# EAGLE schematic 9-de-8 (EAGLE 6.6.0), part 1 of 2

## Sheet 1 of 3
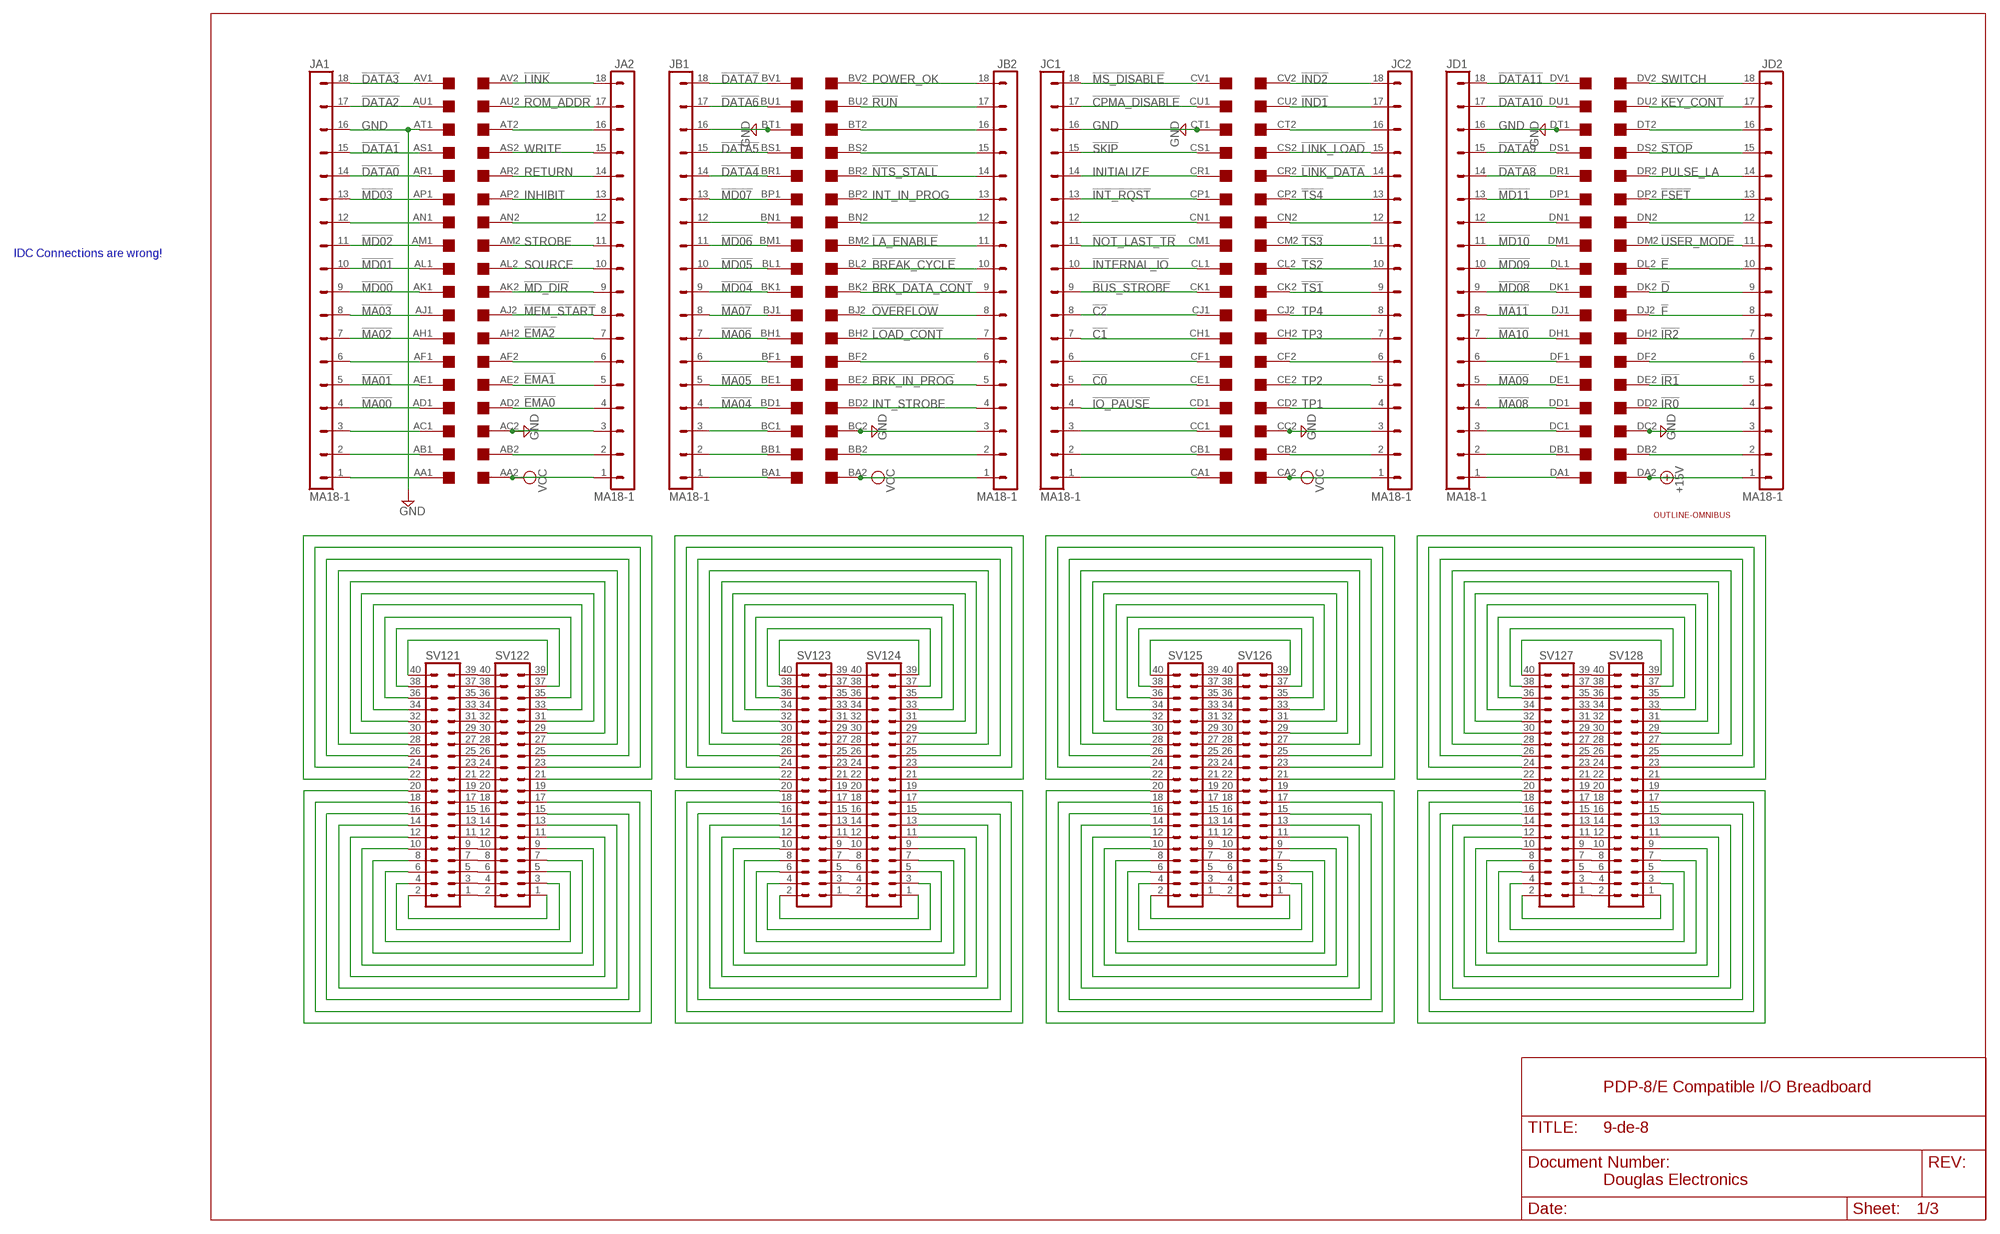
[diagram p0: schematic, sheet 1]

### Parts
JA1  MA18-1  [MA18-1]
JA2  MA18-1  [MA18-1]
JB1  MA18-1  [MA18-1]
JB2  MA18-1  [MA18-1]
JC1  MA18-1  [MA18-1]
JC2  MA18-1  [MA18-1]
JD1  MA18-1  [MA18-1]
JD2  MA18-1  [MA18-1]
SV121  MA20-2  [MA20-2]
SV122  MA20-2  [MA20-2]
SV123  MA20-2  [MA20-2]
SV124  MA20-2  [MA20-2]
SV125  MA20-2  [MA20-2]
SV126  MA20-2  [MA20-2]
SV127  MA20-2  [MA20-2]
SV128  MA20-2  [MA20-2]
U$1  OUTLINE-OMNIBUS  [OMNIBUS]
U$2  QUAD  [EDGE-CON8]

### Nets
!BREAK_CYCLE: JB2.10 U$2.BL2
!BRK_DATA_CONT: JB2.9 U$2.BK2
!BRK_IN_PROG: JB2.5 U$2.BE2
!BUS_STROBE: JC1.9 U$2.CK1
!C0: JC1.5 U$2.CE1
!C1: JC1.7 U$2.CH1
!C2: JC1.8 U$2.CJ1
!CPMA_DISABLE: JC1.17 U$2.CU1
!D: JD2.9 U$2.DK2
!DATA0: JA1.14 U$2.AR1
!DATA1: JA1.15 U$2.AS1
!DATA2: JA1.17 U$2.AU1
!DATA3: JA1.18 U$2.AV1
!DATA4: JB1.14 U$2.BR1
!DATA5: JB1.15 U$2.BS1
!DATA6: JB1.17 U$2.BU1
!DATA7: JB1.18 U$2.BV1
!DATA8: JD1.14 U$2.DR1
!DATA9: JD1.15 U$2.DS1
!DATA10: JD1.17 U$2.DU1
!DATA11: JD1.18 U$2.DV1
!E: JD2.10 U$2.DL2
!EMA0: JA2.4 U$2.AD2
!EMA1: JA2.5 U$2.AE2
!EMA2: JA2.7 U$2.AH2
!F: JD2.8 U$2.DJ2
!FSET: JD2.13 U$2.DP2
!IND1: JC2.17 U$2.CU2
!IND2: JC2.18 U$2.CV2
!INT_RQST: JC1.13 U$2.CP1
!INTERNAL_IO: JC1.10 U$2.CL1
!IO_PAUSE: JC1.4 U$2.CD1
!IR0: JD2.4 U$2.DD2
!IR1: JD2.5 U$2.DE2
!IR2: JD2.7 U$2.DH2
!KEY_CONT: JD2.17 U$2.DU2
!LA_ENABLE: JB2.11 U$2.BM2
!LINK: JA2.18 U$2.AV2
!LINK_DATA: JC2.14 U$2.CR2
!LINK_LOAD: JC2.15 U$2.CS2
!LOAD_CONT: JB2.7 U$2.BH2
!MA00: JA1.4 U$2.AD1
!MA01: JA1.5 U$2.AE1
!MA02: JA1.7 U$2.AH1
!MA03: JA1.8 U$2.AJ1
!MA04: JB1.4 U$2.BD1
!MA05: JB1.5 U$2.BE1
!MA06: JB1.7 U$2.BH1
!MA07: JB1.8 U$2.BJ1
!MA08: JD1.4 U$2.DD1
!MA09: JD1.5 U$2.DE1
!MA10: JD1.7 U$2.DH1
!MA11: JD1.8 U$2.DJ1
!MD00: JA1.9 U$2.AK1
!MD01: JA1.10 U$2.AL1
!MD02: JA1.11 U$2.AM1
!MD03: JA1.13 U$2.AP1
!MD04: JB1.9 U$2.BK1
!MD05: JB1.10 U$2.BL1
!MD06: JB1.11 U$2.BM1
!MD07: JB1.13 U$2.BP1
!MD08: JD1.9 U$2.DK1
!MD09: JD1.10 U$2.DL1
!MD10: JD1.11 U$2.DM1
!MD11: JD1.13 U$2.DP1
!MD_DIR: JA2.9 U$2.AK2
!MEM_START: JA2.8 U$2.AJ2
!MS_DISABLE: JC1.18 U$2.CV1
!NOT_LAST_TR: JC1.11 U$2.CM1
!NTS_STALL: JB2.14 U$2.BR2
!OVERFLOW: JB2.8 U$2.BJ2
!ROM_ADDR: JA2.17 U$2.AU2
!RUN: JB2.17 U$2.BU2
!SKIP: JC1.15 U$2.CS1
!STOP: JD2.15 U$2.DS2
!TS1: JC2.9 U$2.CK2
!TS2: JC2.10 U$2.CL2
!TS3: JC2.11 U$2.CM2
!TS4: JC2.13 U$2.CP2
!USER_MODE: JD2.11 U$2.DM2
+15V: JD2.1 U$2.DA2
GND [supply]: JA1.16 JA2.3 JB1.16 JB2.3 JC1.16 JC2.3 JD1.16 JD2.3 U$2.AC2 U$2.AT1 U$2.BC2 U$2.BT1 U$2.CC2 U$2.CT1 U$2.DC2 U$2.DT1 ; also sheet 3
INHIBIT: JA2.13 U$2.AP2
INITIALIZE: JC1.14 U$2.CR1
INT_IN_PROG: JB2.13 U$2.BP2
INT_STROBE: JB2.4 U$2.BD2
N$46: JA1.2 U$2.AB1
N$47: JA1.1 U$2.AA1
N$48: JB1.2 U$2.BB1
N$49: JB1.1 U$2.BA1
N$50: JC1.1 U$2.CA1
N$51: JB2.15 U$2.BS2
N$52: JC1.2 U$2.CB1
N$53: JD1.1 U$2.DA1
N$54: JD1.2 U$2.DB1
N$243: SV121.1 SV122.2
N$244: SV121.3 SV122.4
N$245: SV121.5 SV122.6
N$246: SV121.7 SV122.8
N$479: SV121.9 SV122.10
N$480: SV121.11 SV122.12
N$481: SV121.13 SV122.14
N$482: SV121.15 SV122.16
N$483: SV121.17 SV122.18
N$484: SV121.19 SV122.20
N$485: SV121.21 SV122.22
N$486: SV121.23 SV122.24
N$487: SV121.25 SV122.26
N$488: SV121.27 SV122.28
N$489: SV121.29 SV122.30
N$490: SV121.31 SV122.32
N$491: SV121.33 SV122.34
N$492: SV121.35 SV122.36
N$493: SV121.37 SV122.38
N$494: SV121.39 SV122.40
N$495: SV123.1 SV124.2
N$496: SV123.3 SV124.4
N$497: SV123.5 SV124.6
N$498: SV123.7 SV124.8
N$499: SV123.9 SV124.10
N$500: SV123.11 SV124.12
N$501: SV123.13 SV124.14
N$502: SV123.15 SV124.16
N$503: SV123.17 SV124.18
N$504: SV123.19 SV124.20
N$505: SV123.21 SV124.22
N$506: SV123.23 SV124.24
N$507: SV123.25 SV124.26
N$508: SV123.27 SV124.28
N$509: SV123.29 SV124.30
N$510: SV123.31 SV124.32
N$511: SV123.33 SV124.34
N$512: SV123.35 SV124.36
N$513: SV123.37 SV124.38
N$514: SV123.39 SV124.40
N$515: SV123.40 SV124.39
N$516: SV123.38 SV124.37
N$517: SV123.36 SV124.35
N$518: SV123.34 SV124.33
N$519: SV123.32 SV124.31
N$520: SV123.2 SV124.1
N$521: SV123.4 SV124.3
N$522: SV123.6 SV124.5
N$523: SV123.8 SV124.7
N$524: SV123.10 SV124.9
N$525: SV123.12 SV124.11
N$526: SV123.30 SV124.29
N$527: SV123.14 SV124.13
N$528: SV123.18 SV124.17
N$529: SV123.20 SV124.19
N$530: SV123.22 SV124.21
N$531: SV123.24 SV124.23
N$532: SV123.26 SV124.25
N$533: SV123.28 SV124.27
N$534: SV123.16 SV124.15
N$535: SV125.1 SV126.2
N$536: SV125.3 SV126.4
N$537: SV125.5 SV126.6
N$538: SV125.7 SV126.8
N$539: SV125.9 SV126.10
N$540: SV125.11 SV126.12
N$541: SV125.13 SV126.14
N$542: SV125.15 SV126.16
N$543: SV125.17 SV126.18
N$544: SV125.19 SV126.20
N$545: SV125.21 SV126.22
N$546: SV125.23 SV126.24
N$547: SV125.25 SV126.26
N$548: SV125.27 SV126.28
N$549: SV125.29 SV126.30
N$550: SV125.31 SV126.32
N$551: SV125.33 SV126.34
N$552: SV125.35 SV126.36
N$553: SV125.37 SV126.38
N$554: SV125.39 SV126.40
N$555: SV121.40 SV122.39
N$556: SV121.38 SV122.37
N$557: SV121.36 SV122.35
N$558: SV121.34 SV122.33
N$559: SV121.32 SV122.31
N$560: SV121.2 SV122.1
N$561: SV121.4 SV122.3
N$562: SV121.6 SV122.5
N$1074: SV121.8 SV122.7
N$1075: SV121.10 SV122.9
N$1076: SV121.12 SV122.11
N$1077: SV121.30 SV122.29
N$1078: SV121.14 SV122.13
N$1079: SV121.16 SV122.15
N$1080: SV121.18 SV122.17
N$1081: SV121.20 SV122.19
N$1082: SV121.22 SV122.21
N$1083: SV121.24 SV122.23
N$1084: SV121.26 SV122.25
N$1085: SV121.28 SV122.27
N$1086: SV125.40 SV126.39
N$1087: SV125.38 SV126.37
N$1088: SV125.36 SV126.35
N$1089: SV125.34 SV126.33
N$1090: SV125.32 SV126.31
N$1091: SV125.2 SV126.1
N$1092: SV125.4 SV126.3
N$1093: SV125.6 SV126.5
N$1094: SV125.8 SV126.7
N$1095: SV125.10 SV126.9
N$1096: SV125.12 SV126.11
N$1097: SV125.30 SV126.29
N$1098: SV125.14 SV126.13
N$1099: SV125.18 SV126.17
N$1100: SV125.20 SV126.19
N$1101: SV125.22 SV126.21
N$1102: SV125.24 SV126.23
N$1103: SV125.26 SV126.25
N$1104: SV125.28 SV126.27
N$1105: SV125.16 SV126.15
N$1106: SV127.1 SV128.2
N$1107: SV127.3 SV128.4
N$1108: SV127.5 SV128.6
N$1109: SV127.7 SV128.8
N$1110: SV127.9 SV128.10
N$1111: SV127.11 SV128.12
N$1112: SV127.13 SV128.14
N$1113: SV127.15 SV128.16
N$1114: SV127.17 SV128.18
N$1115: SV127.19 SV128.20
N$1116: SV127.21 SV128.22
N$1117: SV127.23 SV128.24
N$1118: SV127.25 SV128.26
N$1119: SV127.27 SV128.28
N$1120: SV127.29 SV128.30
N$1121: SV127.31 SV128.32
N$1122: SV127.33 SV128.34
N$1123: SV127.35 SV128.36
N$1124: SV127.37 SV128.38
N$1125: SV127.39 SV128.40
N$1126: SV127.40 SV128.39
N$1127: SV127.38 SV128.37
N$1128: SV127.36 SV128.35
N$1129: SV127.34 SV128.33
N$1130: SV127.32 SV128.31
N$1131: SV127.2 SV128.1
N$1132: SV127.4 SV128.3
N$1133: SV127.6 SV128.5
N$1134: SV127.8 SV128.7
N$1135: SV127.10 SV128.9
N$1136: SV127.12 SV128.11
N$1137: SV127.30 SV128.29
N$1138: SV127.14 SV128.13
N$1139: SV127.18 SV128.17
N$1140: SV127.20 SV128.19
N$1141: SV127.22 SV128.21
N$1142: SV127.24 SV128.23
N$1143: SV127.26 SV128.25
N$1144: SV127.28 SV128.27
N$1145: SV127.16 SV128.15
N$1338 [supply]: JA2.6 U$2.AF2
N$1339 [supply]: JB1.6 U$2.BF1
N$1340 [supply]: JB2.6 U$2.BF2
N$1341 [supply]: JC1.6 U$2.CF1
N$1342 [supply]: JC2.6 U$2.CF2
N$1343 [supply]: JD1.6 U$2.DF1
N$1344 [supply]: JD2.6 U$2.DF2
N$1345 [supply]: JD2.12 U$2.DN2
N$1346 [supply]: JD1.12 U$2.DN1
N$1347 [supply]: JC2.12 U$2.CN2
N$1348 [supply]: JC1.12 U$2.CN1
N$1349 [supply]: JB1.12 U$2.BN1
N$1350 [supply]: JB2.12 U$2.BN2
N$1351 [supply]: JA1.6 U$2.AF1
N$1352 [supply]: JA1.12 U$2.AN1
N$1353 [supply]: JA2.12 U$2.AN2
N$1354 [supply]: JA2.16 U$2.AT2
N$1355 [supply]: JB2.16 U$2.BT2
N$1356 [supply]: JC2.16 U$2.CT2
N$1357 [supply]: JD2.16 U$2.DT2
N$1358 [supply]: JA1.3 U$2.AC1
N$1359 [supply]: JB1.3 U$2.BC1
N$1360 [supply]: JC1.3 U$2.CC1
N$1361 [supply]: JD1.3 U$2.DC1
N$1362 [supply]: JA2.2 U$2.AB2
N$1363 [supply]: JB2.2 U$2.BB2
N$1364 [supply]: JC2.2 U$2.CB2
N$1365 [supply]: JD2.2 U$2.DB2
POWER_OK: JB2.18 U$2.BV2
PULSE_LA: JD2.14 U$2.DR2
RETURN: JA2.14 U$2.AR2
SOURCE: JA2.10 U$2.AL2
STROBE: JA2.11 U$2.AM2
SWITCH: JD2.18 U$2.DV2
TP1: JC2.4 U$2.CD2
TP2: JC2.5 U$2.CE2
TP3: JC2.7 U$2.CH2
TP4: JC2.8 U$2.CJ2
VCC [supply]: JA2.1 JB2.1 JC2.1 U$2.AA2 U$2.BA2 U$2.CA2 ; also sheet 3
WRITE: JA2.15 U$2.AS2

### Notes on the sheet
- IDC Connections are wrong!
- PDP-8/E Compatible I/O Breadboard
- Douglas Electronics

## Sheet 2 of 3
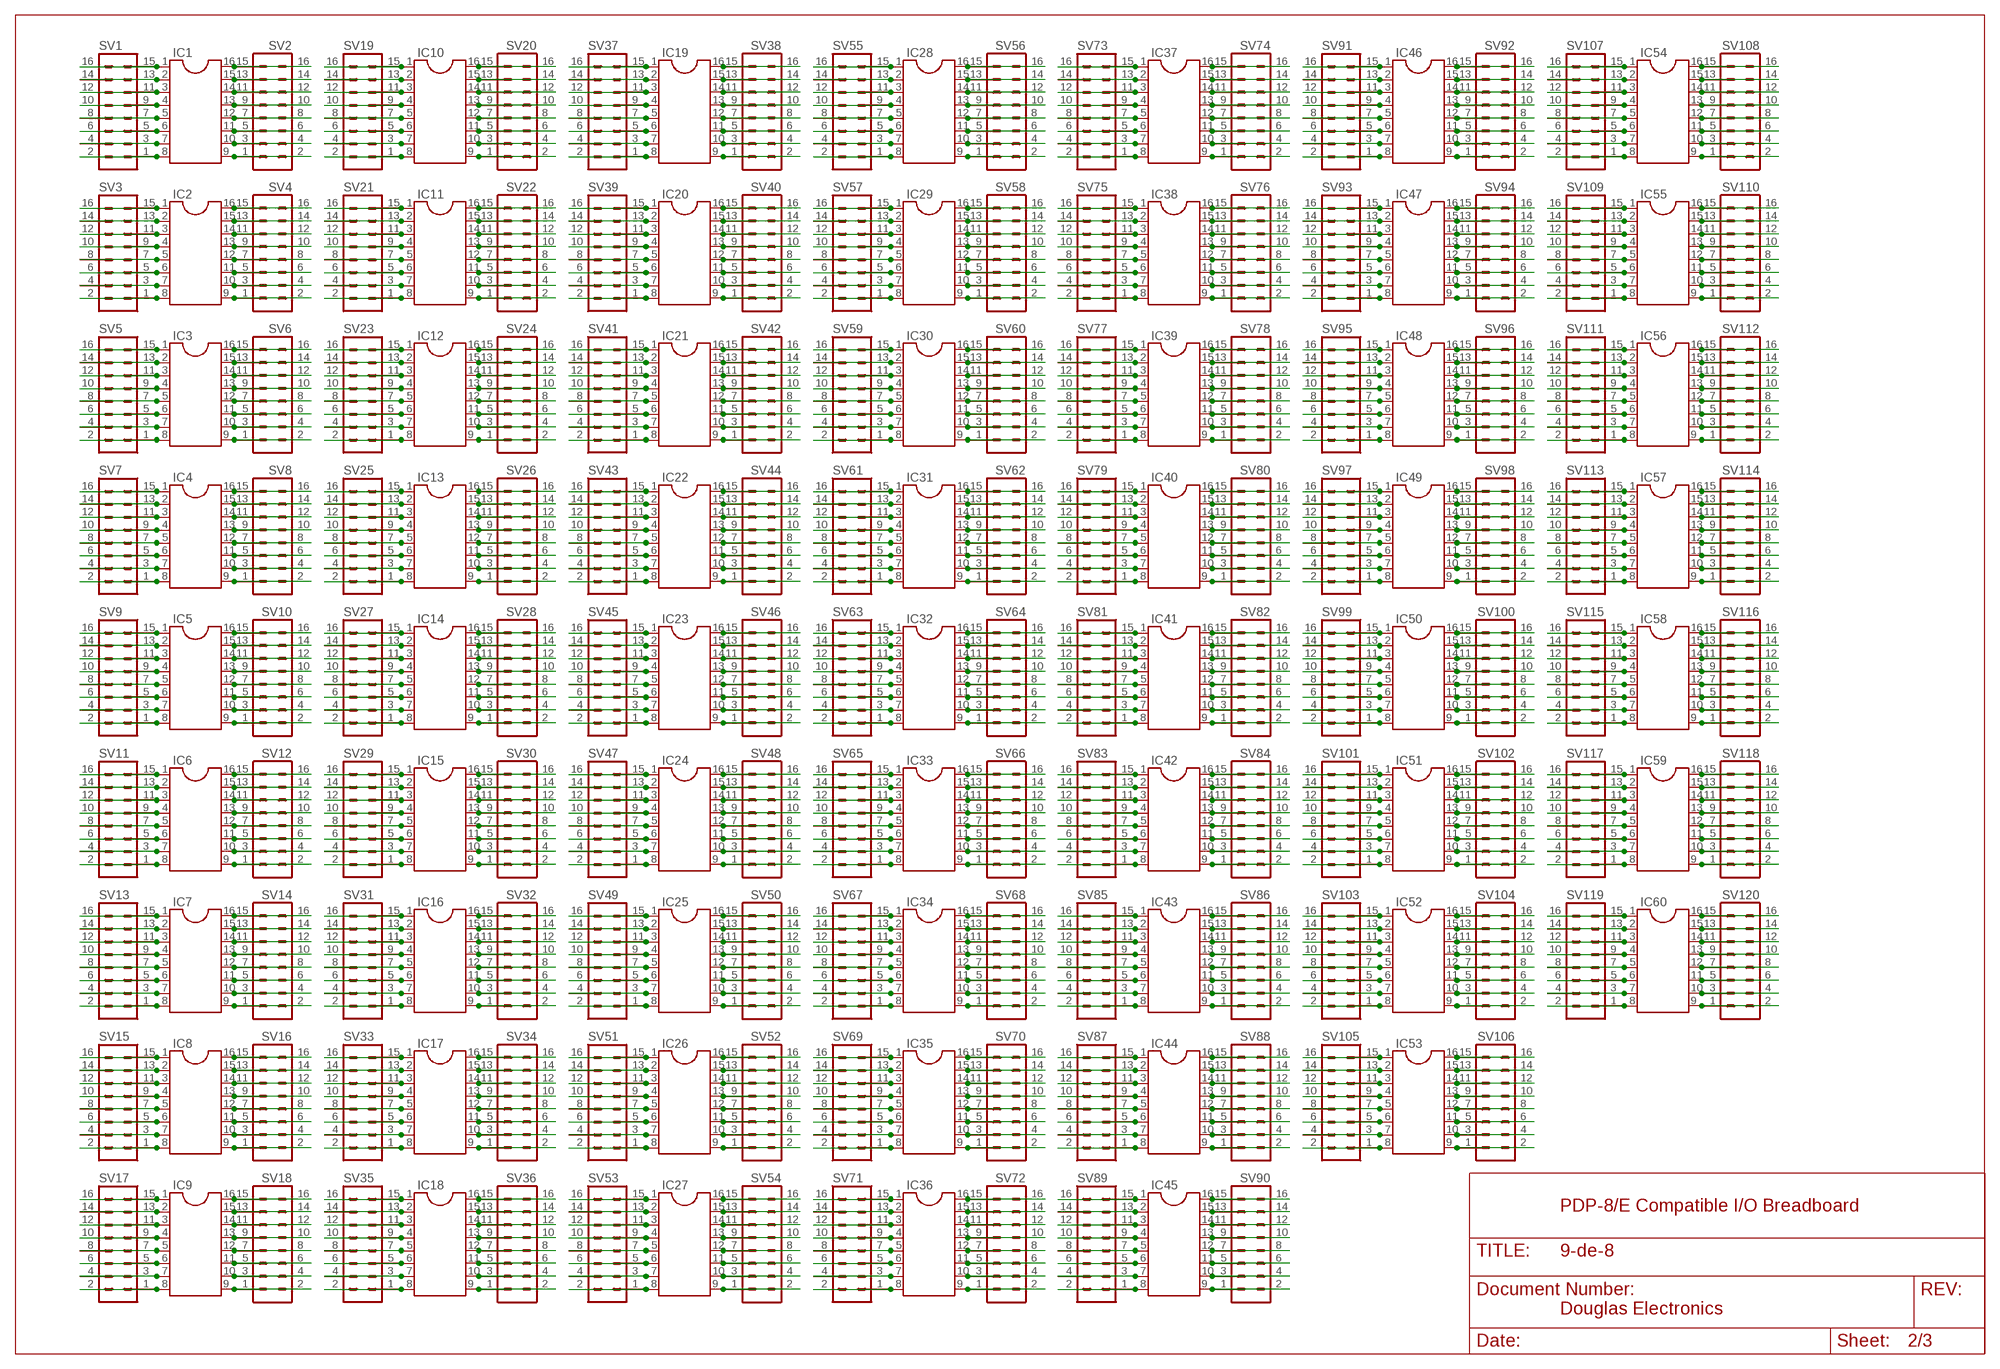
[diagram p1: schematic, sheet 2]

### Parts
IC1  DIL16  [DIL16]
IC2  DIL16  [DIL16]
IC3  DIL16  [DIL16]
IC4  DIL16  [DIL16]
IC5  DIL16  [DIL16]
IC6  DIL16  [DIL16]
IC7  DIL16  [DIL16]
IC8  DIL16  [DIL16]
IC9  DIL16  [DIL16]
IC10  DIL16  [DIL16]
IC11  DIL16  [DIL16]
IC12  DIL16  [DIL16]
IC13  DIL16  [DIL16]
IC14  DIL16  [DIL16]
IC15  DIL16  [DIL16]
IC16  DIL16  [DIL16]
IC17  DIL16  [DIL16]
IC18  DIL16  [DIL16]
IC19  DIL16  [DIL16]
IC20  DIL16  [DIL16]
IC21  DIL16  [DIL16]
IC22  DIL16  [DIL16]
IC23  DIL16  [DIL16]
IC24  DIL16  [DIL16]
IC25  DIL16  [DIL16]
IC26  DIL16  [DIL16]
IC27  DIL16  [DIL16]
IC28  DIL16  [DIL16]
IC29  DIL16  [DIL16]
IC30  DIL16  [DIL16]
IC31  DIL16  [DIL16]
IC32  DIL16  [DIL16]
IC33  DIL16  [DIL16]
IC34  DIL16  [DIL16]
IC35  DIL16  [DIL16]
IC36  DIL16  [DIL16]
IC37  DIL16  [DIL16]
IC38  DIL16  [DIL16]
IC39  DIL16  [DIL16]
IC40  DIL16  [DIL16]
IC41  DIL16  [DIL16]
IC42  DIL16  [DIL16]
IC43  DIL16  [DIL16]
IC44  DIL16  [DIL16]
IC45  DIL16  [DIL16]
IC46  DIL16  [DIL16]
IC47  DIL16  [DIL16]
IC48  DIL16  [DIL16]
IC49  DIL16  [DIL16]
IC50  DIL16  [DIL16]
IC51  DIL16  [DIL16]
IC52  DIL16  [DIL16]
IC53  DIL16  [DIL16]
IC54  DIL16  [DIL16]
IC55  DIL16  [DIL16]
IC56  DIL16  [DIL16]
IC57  DIL16  [DIL16]
IC58  DIL16  [DIL16]
IC59  DIL16  [DIL16]
IC60  DIL16  [DIL16]
SV1  MA08-2  [MA08-2]
SV2  MA08-2  [MA08-2]
SV3  MA08-2  [MA08-2]
SV4  MA08-2  [MA08-2]
SV5  MA08-2  [MA08-2]
SV6  MA08-2  [MA08-2]
SV7  MA08-2  [MA08-2]
SV8  MA08-2  [MA08-2]
SV9  MA08-2  [MA08-2]
SV10  MA08-2  [MA08-2]
SV11  MA08-2  [MA08-2]
SV12  MA08-2  [MA08-2]
SV13  MA08-2  [MA08-2]
SV14  MA08-2  [MA08-2]
SV15  MA08-2  [MA08-2]
SV16  MA08-2  [MA08-2]
SV17  MA08-2  [MA08-2]
SV18  MA08-2  [MA08-2]
SV19  MA08-2  [MA08-2]
SV20  MA08-2  [MA08-2]
SV21  MA08-2  [MA08-2]
SV22  MA08-2  [MA08-2]
SV23  MA08-2  [MA08-2]
SV24  MA08-2  [MA08-2]
SV25  MA08-2  [MA08-2]
SV26  MA08-2  [MA08-2]
SV27  MA08-2  [MA08-2]
SV28  MA08-2  [MA08-2]
SV29  MA08-2  [MA08-2]
SV30  MA08-2  [MA08-2]
SV31  MA08-2  [MA08-2]
SV32  MA08-2  [MA08-2]
SV33  MA08-2  [MA08-2]
SV34  MA08-2  [MA08-2]
SV35  MA08-2  [MA08-2]
SV36  MA08-2  [MA08-2]
SV37  MA08-2  [MA08-2]
SV38  MA08-2  [MA08-2]
SV39  MA08-2  [MA08-2]
SV40  MA08-2  [MA08-2]
SV41  MA08-2  [MA08-2]
SV42  MA08-2  [MA08-2]
SV43  MA08-2  [MA08-2]
SV44  MA08-2  [MA08-2]
SV45  MA08-2  [MA08-2]
SV46  MA08-2  [MA08-2]
SV47  MA08-2  [MA08-2]
SV48  MA08-2  [MA08-2]
SV49  MA08-2  [MA08-2]
SV50  MA08-2  [MA08-2]
SV51  MA08-2  [MA08-2]
SV52  MA08-2  [MA08-2]
SV53  MA08-2  [MA08-2]
SV54  MA08-2  [MA08-2]
SV55  MA08-2  [MA08-2]
SV56  MA08-2  [MA08-2]
SV57  MA08-2  [MA08-2]
SV58  MA08-2  [MA08-2]
SV59  MA08-2  [MA08-2]
SV60  MA08-2  [MA08-2]
SV61  MA08-2  [MA08-2]
SV62  MA08-2  [MA08-2]
SV63  MA08-2  [MA08-2]
SV64  MA08-2  [MA08-2]
SV65  MA08-2  [MA08-2]
SV66  MA08-2  [MA08-2]
SV67  MA08-2  [MA08-2]
SV68  MA08-2  [MA08-2]
SV69  MA08-2  [MA08-2]
SV70  MA08-2  [MA08-2]
SV71  MA08-2  [MA08-2]
SV72  MA08-2  [MA08-2]
SV73  MA08-2  [MA08-2]
SV74  MA08-2  [MA08-2]
SV75  MA08-2  [MA08-2]
SV76  MA08-2  [MA08-2]
SV77  MA08-2  [MA08-2]
SV78  MA08-2  [MA08-2]
SV79  MA08-2  [MA08-2]
SV80  MA08-2  [MA08-2]
SV81  MA08-2  [MA08-2]
SV82  MA08-2  [MA08-2]
SV83  MA08-2  [MA08-2]
SV84  MA08-2  [MA08-2]
SV85  MA08-2  [MA08-2]
SV86  MA08-2  [MA08-2]
SV87  MA08-2  [MA08-2]
SV88  MA08-2  [MA08-2]
SV89  MA08-2  [MA08-2]
SV90  MA08-2  [MA08-2]
SV91  MA08-2  [MA08-2]
SV92  MA08-2  [MA08-2]
SV93  MA08-2  [MA08-2]
SV94  MA08-2  [MA08-2]
SV95  MA08-2  [MA08-2]
SV96  MA08-2  [MA08-2]
SV97  MA08-2  [MA08-2]
SV98  MA08-2  [MA08-2]
SV99  MA08-2  [MA08-2]
SV100  MA08-2  [MA08-2]
SV101  MA08-2  [MA08-2]
SV102  MA08-2  [MA08-2]
SV103  MA08-2  [MA08-2]
SV104  MA08-2  [MA08-2]
SV105  MA08-2  [MA08-2]
SV106  MA08-2  [MA08-2]
SV107  MA08-2  [MA08-2]
SV108  MA08-2  [MA08-2]
SV109  MA08-2  [MA08-2]
SV110  MA08-2  [MA08-2]
SV111  MA08-2  [MA08-2]
SV112  MA08-2  [MA08-2]
SV113  MA08-2  [MA08-2]
SV114  MA08-2  [MA08-2]
SV115  MA08-2  [MA08-2]
SV116  MA08-2  [MA08-2]
SV117  MA08-2  [MA08-2]
SV118  MA08-2  [MA08-2]
SV119  MA08-2  [MA08-2]
SV120  MA08-2  [MA08-2]

### Nets
N$1: IC1.9 SV2.1 SV2.2
N$18: IC1.10 SV2.3 SV2.4
N$19: IC1.11 SV2.5 SV2.6
N$20: IC1.12 SV2.7 SV2.8
N$21: IC1.13 SV2.9 SV2.10
N$22: IC1.14 SV2.11 SV2.12
N$23: IC1.15 SV2.13 SV2.14
N$24: IC1.16 SV2.15 SV2.16
N$25: IC1.8 SV1.1 SV1.2
N$26: IC2.9 SV4.1 SV4.2
N$27: IC2.10 SV4.3 SV4.4
N$28: IC2.11 SV4.5 SV4.6
N$29: IC2.12 SV4.7 SV4.8
N$30: IC2.13 SV4.9 SV4.10
N$31: IC2.14 SV4.11 SV4.12
N$32: IC2.15 SV4.13 SV4.14
N$33: IC2.16 SV4.15 SV4.16
N$34: IC2.8 SV3.1 SV3.2
N$35: IC2.7 SV3.3 SV3.4
N$36: IC2.6 SV3.5 SV3.6
N$37: IC2.5 SV3.7 SV3.8
N$38: IC2.4 SV3.9 SV3.10
N$39: IC2.3 SV3.11 SV3.12
N$40: IC2.2 SV3.13 SV3.14
N$41: IC2.1 SV3.15 SV3.16
N$42: IC1.7 SV1.3 SV1.4
N$43: IC1.6 SV1.5 SV1.6
N$44: IC1.5 SV1.7 SV1.8
N$45: IC1.4 SV1.9 SV1.10
N$55: IC3.9 SV6.1 SV6.2
N$56: IC3.10 SV6.3 SV6.4
N$57: IC3.11 SV6.5 SV6.6
N$58: IC3.12 SV6.7 SV6.8
N$59: IC3.13 SV6.9 SV6.10
N$60: IC3.14 SV6.11 SV6.12
N$61: IC3.15 SV6.13 SV6.14
N$62: IC3.16 SV6.15 SV6.16
N$63: IC3.8 SV5.1 SV5.2
N$64: IC3.7 SV5.3 SV5.4
N$65: IC3.6 SV5.5 SV5.6
N$66: IC3.5 SV5.7 SV5.8
N$67: IC3.4 SV5.9 SV5.10
N$68: IC3.3 SV5.11 SV5.12
N$69: IC3.2 SV5.13 SV5.14
N$70: IC3.1 SV5.15 SV5.16
N$71: IC4.9 SV8.1 SV8.2
N$72: IC4.10 SV8.3 SV8.4
N$73: IC4.11 SV8.5 SV8.6
N$74: IC4.12 SV8.7 SV8.8
N$75: IC4.13 SV8.9 SV8.10
N$76: IC4.14 SV8.11 SV8.12
N$77: IC4.15 SV8.13 SV8.14
N$78: IC4.16 SV8.15 SV8.16
N$79: IC4.8 SV7.1 SV7.2
N$80: IC4.7 SV7.3 SV7.4
N$81: IC4.6 SV7.5 SV7.6
N$82: IC4.5 SV7.7 SV7.8
N$83: IC4.4 SV7.9 SV7.10
N$84: IC4.3 SV7.11 SV7.12
N$85: IC4.2 SV7.13 SV7.14
N$86: IC4.1 SV7.15 SV7.16
N$87: IC5.9 SV10.1 SV10.2
N$88: IC5.10 SV10.3 SV10.4
N$89: IC5.11 SV10.5 SV10.6
N$90: IC5.12 SV10.7 SV10.8
N$91: IC5.13 SV10.9 SV10.10
N$92: IC5.14 SV10.11 SV10.12
N$93: IC5.15 SV10.13 SV10.14
N$94: IC5.16 SV10.15 SV10.16
N$95: IC5.8 SV9.1 SV9.2
N$96: IC5.7 SV9.3 SV9.4
N$97: IC5.6 SV9.5 SV9.6
N$98: IC5.5 SV9.7 SV9.8
N$99: IC5.4 SV9.9 SV9.10
N$100: IC5.3 SV9.11 SV9.12
N$101: IC5.2 SV9.13 SV9.14
N$102: IC5.1 SV9.15 SV9.16
N$103: IC6.9 SV12.1 SV12.2
N$104: IC6.10 SV12.3 SV12.4
N$105: IC6.11 SV12.5 SV12.6
N$106: IC6.12 SV12.7 SV12.8
N$107: IC6.13 SV12.9 SV12.10
N$108: IC6.14 SV12.11 SV12.12
N$109: IC6.15 SV12.13 SV12.14
N$110: IC6.16 SV12.15 SV12.16
N$111: IC6.8 SV11.1 SV11.2
N$112: IC6.7 SV11.3 SV11.4
N$113: IC6.6 SV11.5 SV11.6
N$114: IC6.5 SV11.7 SV11.8
N$115: IC6.4 SV11.9 SV11.10
N$116: IC6.3 SV11.11 SV11.12
N$117: IC6.2 SV11.13 SV11.14
N$118: IC6.1 SV11.15 SV11.16
N$119: IC7.9 SV14.1 SV14.2
N$120: IC7.10 SV14.3 SV14.4
N$121: IC7.11 SV14.5 SV14.6
N$122: IC7.12 SV14.7 SV14.8
N$123: IC7.13 SV14.9 SV14.10
N$124: IC7.14 SV14.11 SV14.12
N$125: IC7.15 SV14.13 SV14.14
N$126: IC7.16 SV14.15 SV14.16
N$127: IC7.8 SV13.1 SV13.2
N$128: IC7.7 SV13.3 SV13.4
N$129: IC7.6 SV13.5 SV13.6
N$130: IC7.5 SV13.7 SV13.8
N$131: IC7.4 SV13.9 SV13.10
N$132: IC7.3 SV13.11 SV13.12
N$133: IC7.2 SV13.13 SV13.14
N$134: IC7.1 SV13.15 SV13.16
N$135: IC8.9 SV16.1 SV16.2
N$136: IC8.10 SV16.3 SV16.4
N$137: IC8.11 SV16.5 SV16.6
N$138: IC8.12 SV16.7 SV16.8
N$139: IC8.13 SV16.9 SV16.10
N$140: IC8.14 SV16.11 SV16.12
N$141: IC8.15 SV16.13 SV16.14
N$142: IC8.16 SV16.15 SV16.16
N$143: IC8.8 SV15.1 SV15.2
N$144: IC8.7 SV15.3 SV15.4
N$145: IC8.6 SV15.5 SV15.6
N$146: IC8.5 SV15.7 SV15.8
N$147: IC8.4 SV15.9 SV15.10
N$148: IC8.3 SV15.11 SV15.12
N$149: IC8.2 SV15.13 SV15.14
N$150: IC8.1 SV15.15 SV15.16
N$151: IC9.9 SV18.1 SV18.2
N$152: IC9.10 SV18.3 SV18.4
N$153: IC9.11 SV18.5 SV18.6
N$154: IC9.12 SV18.7 SV18.8
N$155: IC9.13 SV18.9 SV18.10
N$156: IC9.14 SV18.11 SV18.12
N$157: IC9.15 SV18.13 SV18.14
N$158: IC9.16 SV18.15 SV18.16
N$159: IC9.8 SV17.1 SV17.2
N$160: IC9.7 SV17.3 SV17.4
N$161: IC9.6 SV17.5 SV17.6
N$162: IC9.5 SV17.7 SV17.8
N$163: IC9.4 SV17.9 SV17.10
N$164: IC9.3 SV17.11 SV17.12
N$165: IC9.2 SV17.13 SV17.14
N$166: IC9.1 SV17.15 SV17.16
N$167: IC10.9 SV20.1 SV20.2
N$168: IC10.10 SV20.3 SV20.4
N$169: IC10.11 SV20.5 SV20.6
N$170: IC10.12 SV20.7 SV20.8
N$171: IC10.13 SV20.9 SV20.10
N$172: IC10.14 SV20.11 SV20.12
N$173: IC10.15 SV20.13 SV20.14
N$174: IC10.16 SV20.15 SV20.16
N$175: IC10.8 SV19.1 SV19.2
N$176: IC10.7 SV19.3 SV19.4
N$177: IC10.6 SV19.5 SV19.6
N$178: IC10.5 SV19.7 SV19.8
N$179: IC10.4 SV19.9 SV19.10
N$180: IC10.3 SV19.11 SV19.12
N$181: IC10.2 SV19.13 SV19.14
N$182: IC10.1 SV19.15 SV19.16
N$183: IC11.9 SV22.1 SV22.2
N$184: IC11.10 SV22.3 SV22.4
N$185: IC11.11 SV22.5 SV22.6
N$186: IC11.12 SV22.7 SV22.8
N$187: IC11.13 SV22.9 SV22.10
N$188: IC11.14 SV22.11 SV22.12
N$189: IC11.15 SV22.13 SV22.14
N$190: IC11.16 SV22.15 SV22.16
N$191: IC11.8 SV21.1 SV21.2
N$192: IC11.7 SV21.3 SV21.4
N$193: IC11.6 SV21.5 SV21.6
N$194: IC11.5 SV21.7 SV21.8
N$195: IC11.4 SV21.9 SV21.10
N$196: IC11.3 SV21.11 SV21.12
N$197: IC11.2 SV21.13 SV21.14
N$198: IC11.1 SV21.15 SV21.16
N$199: IC12.9 SV24.1 SV24.2
N$200: IC12.10 SV24.3 SV24.4
N$201: IC12.11 SV24.5 SV24.6
N$202: IC12.12 SV24.7 SV24.8
N$203: IC12.13 SV24.9 SV24.10
N$204: IC12.14 SV24.11 SV24.12
N$205: IC12.15 SV24.13 SV24.14
N$206: IC12.16 SV24.15 SV24.16
N$207: IC12.8 SV23.1 SV23.2
N$208: IC12.7 SV23.3 SV23.4
N$209: IC12.6 SV23.5 SV23.6
N$210: IC12.5 SV23.7 SV23.8
N$211: IC12.4 SV23.9 SV23.10
N$212: IC12.3 SV23.11 SV23.12
N$213: IC12.2 SV23.13 SV23.14
N$214: IC12.1 SV23.15 SV23.16
N$215: IC13.9 SV26.1 SV26.2
N$216: IC13.10 SV26.3 SV26.4
N$217: IC13.11 SV26.5 SV26.6
N$218: IC13.12 SV26.7 SV26.8
N$219: IC13.13 SV26.9 SV26.10
N$220: IC13.14 SV26.11 SV26.12
N$221: IC13.15 SV26.13 SV26.14
N$222: IC13.16 SV26.15 SV26.16
N$223: IC13.8 SV25.1 SV25.2
N$224: IC13.7 SV25.3 SV25.4
N$225: IC13.6 SV25.5 SV25.6
N$226: IC13.5 SV25.7 SV25.8
N$227: IC13.4 SV25.9 SV25.10
N$228: IC13.3 SV25.11 SV25.12
N$229: IC13.2 SV25.13 SV25.14
N$230: IC13.1 SV25.15 SV25.16
N$231: IC14.9 SV28.1 SV28.2
N$232: IC14.10 SV28.3 SV28.4
N$233: IC14.11 SV28.5 SV28.6
N$234: IC14.12 SV28.7 SV28.8
N$235: IC14.13 SV28.9 SV28.10
N$236: IC14.14 SV28.11 SV28.12
N$237: IC14.15 SV28.13 SV28.14
N$238: IC14.16 SV28.15 SV28.16
N$239: IC14.8 SV27.1 SV27.2
N$240: IC14.7 SV27.3 SV27.4
N$241: IC14.6 SV27.5 SV27.6
N$242: IC14.5 SV27.7 SV27.8
N$247: IC14.4 SV27.9 SV27.10
N$248: IC14.3 SV27.11 SV27.12
N$249: IC14.2 SV27.13 SV27.14
N$250: IC14.1 SV27.15 SV27.16
N$251: IC15.9 SV30.1 SV30.2
N$252: IC15.10 SV30.3 SV30.4
N$253: IC15.11 SV30.5 SV30.6
N$254: IC15.12 SV30.7 SV30.8
N$255: IC15.13 SV30.9 SV30.10
N$256: IC15.14 SV30.11 SV30.12
N$257: IC15.15 SV30.13 SV30.14
N$258: IC15.16 SV30.15 SV30.16
N$259: IC15.8 SV29.1 SV29.2
N$260: IC15.7 SV29.3 SV29.4
N$261: IC15.6 SV29.5 SV29.6
N$262: IC15.5 SV29.7 SV29.8
N$263: IC15.4 SV29.9 SV29.10
N$264: IC15.3 SV29.11 SV29.12
N$265: IC15.2 SV29.13 SV29.14
N$266: IC15.1 SV29.15 SV29.16
N$267: IC16.9 SV32.1 SV32.2
N$268: IC16.10 SV32.3 SV32.4
N$269: IC16.11 SV32.5 SV32.6
N$270: IC16.12 SV32.7 SV32.8
N$271: IC16.13 SV32.9 SV32.10
N$272: IC16.14 SV32.11 SV32.12
N$273: IC16.15 SV32.13 SV32.14
N$274: IC16.16 SV32.15 SV32.16
N$275: IC16.8 SV31.1 SV31.2
N$276: IC16.7 SV31.3 SV31.4
N$277: IC16.6 SV31.5 SV31.6
N$278: IC16.5 SV31.7 SV31.8
N$279: IC16.4 SV31.9 SV31.10
N$280: IC16.3 SV31.11 SV31.12
N$281: IC16.2 SV31.13 SV31.14
N$282: IC16.1 SV31.15 SV31.16
N$283: IC17.9 SV34.1 SV34.2
N$284: IC17.10 SV34.3 SV34.4
N$285: IC17.11 SV34.5 SV34.6
N$286: IC17.12 SV34.7 SV34.8
N$287: IC17.13 SV34.9 SV34.10
N$288: IC17.14 SV34.11 SV34.12
N$289: IC17.15 SV34.13 SV34.14
N$290: IC17.16 SV34.15 SV34.16
N$291: IC17.8 SV33.1 SV33.2
N$292: IC17.7 SV33.3 SV33.4
N$293: IC17.6 SV33.5 SV33.6
N$294: IC17.5 SV33.7 SV33.8
N$295: IC17.4 SV33.9 SV33.10
N$296: IC17.3 SV33.11 SV33.12
N$297: IC17.2 SV33.13 SV33.14
N$298: IC17.1 SV33.15 SV33.16
N$299: IC18.9 SV36.1 SV36.2
N$300: IC18.10 SV36.3 SV36.4
N$301: IC18.11 SV36.5 SV36.6
N$302: IC18.12 SV36.7 SV36.8
N$303: IC18.13 SV36.9 SV36.10
N$304: IC18.14 SV36.11 SV36.12
N$305: IC18.15 SV36.13 SV36.14
N$306: IC18.16 SV36.15 SV36.16
N$307: IC18.8 SV35.1 SV35.2
N$308: IC18.7 SV35.3 SV35.4
N$309: IC18.6 SV35.5 SV35.6
N$310: IC18.5 SV35.7 SV35.8
N$311: IC18.4 SV35.9 SV35.10
N$312: IC18.3 SV35.11 SV35.12
N$313: IC18.2 SV35.13 SV35.14
N$314: IC18.1 SV35.15 SV35.16
N$315: IC19.9 SV38.1 SV38.2
N$316: IC19.10 SV38.3 SV38.4
N$317: IC19.11 SV38.5 SV38.6
N$318: IC19.12 SV38.7 SV38.8
N$319: IC19.13 SV38.9 SV38.10
N$320: IC19.14 SV38.11 SV38.12
N$321: IC19.15 SV38.13 SV38.14
N$322: IC19.16 SV38.15 SV38.16
N$323: IC19.8 SV37.1 SV37.2
N$324: IC19.7 SV37.3 SV37.4
N$325: IC19.6 SV37.5 SV37.6
N$326: IC19.5 SV37.7 SV37.8
N$327: IC19.4 SV37.9 SV37.10
N$328: IC19.3 SV37.11 SV37.12
N$329: IC19.2 SV37.13 SV37.14
N$330: IC19.1 SV37.15 SV37.16
N$331: IC20.9 SV40.1 SV40.2
N$332: IC20.10 SV40.3 SV40.4
N$333: IC20.11 SV40.5 SV40.6
N$334: IC20.12 SV40.7 SV40.8
N$335: IC20.13 SV40.9 SV40.10
N$336: IC20.14 SV40.11 SV40.12
N$337: IC20.15 SV40.13 SV40.14
N$338: IC20.16 SV40.15 SV40.16
N$339: IC20.8 SV39.1 SV39.2
N$340: IC20.7 SV39.3 SV39.4
N$341: IC20.6 SV39.5 SV39.6
N$342: IC20.5 SV39.7 SV39.8
N$343: IC20.4 SV39.9 SV39.10
N$344: IC20.3 SV39.11 SV39.12
N$345: IC20.2 SV39.13 SV39.14
N$346: IC20.1 SV39.15 SV39.16
N$347: IC21.9 SV42.1 SV42.2
N$348: IC21.10 SV42.3 SV42.4
N$349: IC21.11 SV42.5 SV42.6
N$350: IC21.12 SV42.7 SV42.8
N$351: IC21.13 SV42.9 SV42.10
N$352: IC21.14 SV42.11 SV42.12
N$353: IC21.15 SV42.13 SV42.14
N$354: IC21.16 SV42.15 SV42.16
N$355: IC21.8 SV41.1 SV41.2
N$356: IC21.7 SV41.3 SV41.4
N$357: IC21.6 SV41.5 SV41.6
N$358: IC21.5 SV41.7 SV41.8
N$359: IC21.4 SV41.9 SV41.10
N$360: IC21.3 SV41.11 SV41.12
N$361: IC21.2 SV41.13 SV41.14
N$362: IC21.1 SV41.15 SV41.16
N$363: IC22.9 SV44.1 SV44.2
N$364: IC22.10 SV44.3 SV44.4
N$365: IC22.11 SV44.5 SV44.6
N$366: IC22.12 SV44.7 SV44.8
N$367: IC22.13 SV44.9 SV44.10
N$368: IC22.14 SV44.11 SV44.12
N$369: IC22.15 SV44.13 SV44.14
N$370: IC22.16 SV44.15 SV44.16
N$371: IC22.8 SV43.1 SV43.2
N$372: IC22.7 SV43.3 SV43.4
N$373: IC22.6 SV43.5 SV43.6
N$374: IC22.5 SV43.7 SV43.8
N$375: IC22.4 SV43.9 SV43.10
N$376: IC22.3 SV43.11 SV43.12
N$377: IC22.2 SV43.13 SV43.14
N$378: IC22.1 SV43.15 SV43.16
N$379: IC23.9 SV46.1 SV46.2
N$380: IC23.10 SV46.3 SV46.4
N$381: IC23.11 SV46.5 SV46.6
N$382: IC23.12 SV46.7 SV46.8
N$383: IC23.13 SV46.9 SV46.10
N$384: IC23.14 SV46.11 SV46.12
N$385: IC23.15 SV46.13 SV46.14
N$386: IC23.16 SV46.15 SV46.16
N$387: IC23.8 SV45.1 SV45.2
N$388: IC23.7 SV45.3 SV45.4
N$389: IC23.6 SV45.5 SV45.6
N$390: IC23.5 SV45.7 SV45.8
N$391: IC23.4 SV45.9 SV45.10
N$392: IC23.3 SV45.11 SV45.12
N$393: IC23.2 SV45.13 SV45.14
N$394: IC23.1 SV45.15 SV45.16
N$395: IC24.9 SV48.1 SV48.2
N$396: IC24.10 SV48.3 SV48.4
N$397: IC24.11 SV48.5 SV48.6
N$398: IC24.12 SV48.7 SV48.8
N$399: IC24.13 SV48.9 SV48.10
N$400: IC24.14 SV48.11 SV48.12
N$401: IC24.15 SV48.13 SV48.14
N$402: IC24.16 SV48.15 SV48.16
N$403: IC24.8 SV47.1 SV47.2
N$404: IC24.7 SV47.3 SV47.4
N$405: IC24.6 SV47.5 SV47.6
N$406: IC24.5 SV47.7 SV47.8
N$407: IC24.4 SV47.9 SV47.10
N$408: IC24.3 SV47.11 SV47.12
N$409: IC24.2 SV47.13 SV47.14
N$410: IC24.1 SV47.15 SV47.16
N$411: IC25.9 SV50.1 SV50.2
N$412: IC25.10 SV50.3 SV50.4
N$413: IC25.11 SV50.5 SV50.6
N$414: IC25.12 SV50.7 SV50.8
N$415: IC25.13 SV50.9 SV50.10
N$416: IC25.14 SV50.11 SV50.12
N$417: IC25.15 SV50.13 SV50.14
N$418: IC25.16 SV50.15 SV50.16
N$419: IC25.8 SV49.1 SV49.2
N$420: IC25.7 SV49.3 SV49.4
N$421: IC25.6 SV49.5 SV49.6
N$422: IC25.5 SV49.7 SV49.8
N$423: IC25.4 SV49.9 SV49.10
N$424: IC25.3 SV49.11 SV49.12
N$425: IC25.2 SV49.13 SV49.14
N$426: IC25.1 SV49.15 SV49.16
N$427: IC26.9 SV52.1 SV52.2
N$428: IC26.10 SV52.3 SV52.4
N$429: IC26.11 SV52.5 SV52.6
N$430: IC26.12 SV52.7 SV52.8
N$431: IC26.13 SV52.9 SV52.10
N$432: IC26.14 SV52.11 SV52.12
N$433: IC26.15 SV52.13 SV52.14
N$434: IC26.16 SV52.15 SV52.16
N$435: IC26.8 SV51.1 SV51.2
N$436: IC26.7 SV51.3 SV51.4
N$437: IC26.6 SV51.5 SV51.6
N$438: IC26.5 SV51.7 SV51.8
N$439: IC26.4 SV51.9 SV51.10
N$440: IC26.3 SV51.11 SV51.12
N$441: IC26.2 SV51.13 SV51.14
N$442: IC26.1 SV51.15 SV51.16
N$443: IC27.9 SV54.1 SV54.2
N$444: IC27.10 SV54.3 SV54.4
N$445: IC27.11 SV54.5 SV54.6
N$446: IC27.12 SV54.7 SV54.8
N$447: IC27.13 SV54.9 SV54.10
N$448: IC27.14 SV54.11 SV54.12
N$449: IC27.15 SV54.13 SV54.14
N$450: IC27.16 SV54.15 SV54.16
N$451: IC27.8 SV53.1 SV53.2
N$452: IC27.7 SV53.3 SV53.4
N$453: IC27.6 SV53.5 SV53.6
N$454: IC27.5 SV53.7 SV53.8
N$455: IC27.4 SV53.9 SV53.10
N$456: IC27.3 SV53.11 SV53.12
N$457: IC27.2 SV53.13 SV53.14
N$458: IC27.1 SV53.15 SV53.16
N$459: IC28.9 SV56.1 SV56.2
N$460: IC28.10 SV56.3 SV56.4
N$461: IC28.11 SV56.5 SV56.6
N$462: IC28.12 SV56.7 SV56.8
N$463: IC28.13 SV56.9 SV56.10
N$464: IC28.14 SV56.11 SV56.12
N$465: IC28.15 SV56.13 SV56.14
N$466: IC28.16 SV56.15 SV56.16
N$467: IC28.8 SV55.1 SV55.2
N$468: IC28.7 SV55.3 SV55.4
N$469: IC28.6 SV55.5 SV55.6
N$470: IC28.5 SV55.7 SV55.8
N$471: IC28.4 SV55.9 SV55.10
N$472: IC28.3 SV55.11 SV55.12
N$473: IC28.2 SV55.13 SV55.14
N$474: IC28.1 SV55.15 SV55.16
N$475: IC29.9 SV58.1 SV58.2
N$476: IC29.10 SV58.3 SV58.4
N$477: IC29.11 SV58.5 SV58.6
N$478: IC29.12 SV58.7 SV58.8
N$563: IC1.3 SV1.11 SV1.12
N$564: IC1.2 SV1.13 SV1.14
N$565: IC1.1 SV1.15 SV1.16
N$566: IC29.13 SV58.9 SV58.10
N$567: IC29.14 SV58.11 SV58.12
N$568: IC29.15 SV58.13 SV58.14
N$569: IC29.16 SV58.15 SV58.16
N$570: IC29.8 SV57.1 SV57.2
N$571: IC29.7 SV57.3 SV57.4
N$572: IC29.6 SV57.5 SV57.6
N$573: IC29.5 SV57.7 SV57.8
N$574: IC29.4 SV57.9 SV57.10
N$575: IC29.3 SV57.11 SV57.12
N$576: IC29.2 SV57.13 SV57.14
N$577: IC29.1 SV57.15 SV57.16
N$578: IC30.9 SV60.1 SV60.2
N$579: IC30.10 SV60.3 SV60.4
N$580: IC30.11 SV60.5 SV60.6
N$581: IC30.12 SV60.7 SV60.8
N$582: IC30.13 SV60.9 SV60.10
N$583: IC30.14 SV60.11 SV60.12
N$584: IC30.15 SV60.13 SV60.14
N$585: IC30.16 SV60.15 SV60.16
N$586: IC30.8 SV59.1 SV59.2
N$587: IC30.7 SV59.3 SV59.4
N$588: IC30.6 SV59.5 SV59.6
N$589: IC30.5 SV59.7 SV59.8
N$590: IC30.4 SV59.9 SV59.10
N$591: IC30.3 SV59.11 SV59.12
N$592: IC30.2 SV59.13 SV59.14
N$593: IC30.1 SV59.15 SV59.16
N$594: IC31.9 SV62.1 SV62.2
N$595: IC31.10 SV62.3 SV62.4
N$596: IC31.11 SV62.5 SV62.6
N$597: IC31.12 SV62.7 SV62.8
N$598: IC31.13 SV62.9 SV62.10
N$599: IC31.14 SV62.11 SV62.12
N$600: IC31.15 SV62.13 SV62.14
N$601: IC31.16 SV62.15 SV62.16
N$602: IC31.8 SV61.1 SV61.2
N$603: IC31.7 SV61.3 SV61.4
N$604: IC31.6 SV61.5 SV61.6
N$605: IC31.5 SV61.7 SV61.8
N$606: IC31.4 SV61.9 SV61.10
N$607: IC31.3 SV61.11 SV61.12
N$608: IC31.2 SV61.13 SV61.14
N$609: IC31.1 SV61.15 SV61.16
N$610: IC32.9 SV64.1 SV64.2
N$611: IC32.10 SV64.3 SV64.4
N$612: IC32.11 SV64.5 SV64.6
N$613: IC32.12 SV64.7 SV64.8
N$614: IC32.13 SV64.9 SV64.10
N$615: IC32.14 SV64.11 SV64.12
N$616: IC32.15 SV64.13 SV64.14
N$617: IC32.16 SV64.15 SV64.16
N$618: IC32.8 SV63.1 SV63.2
N$619: IC32.7 SV63.3 SV63.4
N$620: IC32.6 SV63.5 SV63.6
N$621: IC32.5 SV63.7 SV63.8
N$622: IC32.4 SV63.9 SV63.10
N$623: IC32.3 SV63.11 SV63.12
N$624: IC32.2 SV63.13 SV63.14
N$625: IC32.1 SV63.15 SV63.16
N$626: IC33.9 SV66.1 SV66.2
N$627: IC33.10 SV66.3 SV66.4
N$628: IC33.11 SV66.5 SV66.6
N$629: IC33.12 SV66.7 SV66.8
N$630: IC33.13 SV66.9 SV66.10
N$631: IC33.14 SV66.11 SV66.12
N$632: IC33.15 SV66.13 SV66.14
N$633: IC33.16 SV66.15 SV66.16
N$634: IC33.8 SV65.1 SV65.2
N$635: IC33.7 SV65.3 SV65.4
N$636: IC33.6 SV65.5 SV65.6
N$637: IC33.5 SV65.7 SV65.8
N$638: IC33.4 SV65.9 SV65.10
N$639: IC33.3 SV65.11 SV65.12
N$640: IC33.2 SV65.13 SV65.14
N$641: IC33.1 SV65.15 SV65.16
N$642: IC34.9 SV68.1 SV68.2
N$643: IC34.10 SV68.3 SV68.4
N$644: IC34.11 SV68.5 SV68.6
N$645: IC34.12 SV68.7 SV68.8
N$646: IC34.13 SV68.9 SV68.10
N$647: IC34.14 SV68.11 SV68.12
N$648: IC34.15 SV68.13 SV68.14
N$649: IC34.16 SV68.15 SV68.16
N$650: IC34.8 SV67.1 SV67.2
N$651: IC34.7 SV67.3 SV67.4
N$652: IC34.6 SV67.5 SV67.6
N$653: IC34.5 SV67.7 SV67.8
N$654: IC34.4 SV67.9 SV67.10
N$655: IC34.3 SV67.11 SV67.12
N$656: IC34.2 SV67.13 SV67.14
N$657: IC34.1 SV67.15 SV67.16
N$658: IC35.9 SV70.1 SV70.2
N$659: IC35.10 SV70.3 SV70.4
N$660: IC35.11 SV70.5 SV70.6
N$661: IC35.12 SV70.7 SV70.8
N$662: IC35.13 SV70.9 SV70.10
N$663: IC35.14 SV70.11 SV70.12
N$664: IC35.15 SV70.13 SV70.14
N$665: IC35.16 SV70.15 SV70.16
N$666: IC35.8 SV69.1 SV69.2
N$667: IC35.7 SV69.3 SV69.4
N$668: IC35.6 SV69.5 SV69.6
N$669: IC35.5 SV69.7 SV69.8
N$670: IC35.4 SV69.9 SV69.10
N$671: IC35.3 SV69.11 SV69.12
N$672: IC35.2 SV69.13 SV69.14
N$673: IC35.1 SV69.15 SV69.16
N$674: IC36.9 SV72.1 SV72.2
N$675: IC36.10 SV72.3 SV72.4
N$676: IC36.11 SV72.5 SV72.6
N$677: IC36.12 SV72.7 SV72.8
N$678: IC36.13 SV72.9 SV72.10
N$679: IC36.14 SV72.11 SV72.12
N$680: IC36.15 SV72.13 SV72.14
N$681: IC36.16 SV72.15 SV72.16
N$682: IC36.8 SV71.1 SV71.2
N$683: IC36.7 SV71.3 SV71.4
N$684: IC36.6 SV71.5 SV71.6
N$685: IC36.5 SV71.7 SV71.8
N$686: IC36.4 SV71.9 SV71.10
N$687: IC36.3 SV71.11 SV71.12
N$688: IC36.2 SV71.13 SV71.14
N$689: IC36.1 SV71.15 SV71.16
N$690: IC37.9 SV74.1 SV74.2
N$691: IC37.10 SV74.3 SV74.4
N$692: IC37.11 SV74.5 SV74.6
N$693: IC37.12 SV74.7 SV74.8
N$694: IC37.13 SV74.9 SV74.10
N$695: IC37.14 SV74.11 SV74.12
N$696: IC37.15 SV74.13 SV74.14
N$697: IC37.16 SV74.15 SV74.16
N$698: IC37.8 SV73.1 SV73.2
N$699: IC37.7 SV73.3 SV73.4
N$700: IC37.6 SV73.5 SV73.6
N$701: IC37.5 SV73.7 SV73.8
N$702: IC37.4 SV73.9 SV73.10
N$703: IC37.3 SV73.11 SV73.12
N$704: IC37.2 SV73.13 SV73.14
N$705: IC37.1 SV73.15 SV73.16
N$706: IC38.9 SV76.1 SV76.2
N$707: IC38.10 SV76.3 SV76.4
N$708: IC38.11 SV76.5 SV76.6
N$709: IC38.12 SV76.7 SV76.8
N$710: IC38.13 SV76.9 SV76.10
N$711: IC38.14 SV76.11 SV76.12
N$712: IC38.15 SV76.13 SV76.14
N$713: IC38.16 SV76.15 SV76.16
N$714: IC38.8 SV75.1 SV75.2
N$715: IC38.7 SV75.3 SV75.4
N$716: IC38.6 SV75.5 SV75.6
N$717: IC38.5 SV75.7 SV75.8
N$718: IC38.4 SV75.9 SV75.10
N$719: IC38.3 SV75.11 SV75.12
N$720: IC38.2 SV75.13 SV75.14
N$721: IC38.1 SV75.15 SV75.16
N$722: IC39.9 SV78.1 SV78.2
N$723: IC39.10 SV78.3 SV78.4
N$724: IC39.11 SV78.5 SV78.6
N$725: IC39.12 SV78.7 SV78.8
N$726: IC39.13 SV78.9 SV78.10
N$727: IC39.14 SV78.11 SV78.12
N$728: IC39.15 SV78.13 SV78.14
N$729: IC39.16 SV78.15 SV78.16
N$730: IC39.8 SV77.1 SV77.2
N$731: IC39.7 SV77.3 SV77.4
N$732: IC39.6 SV77.5 SV77.6
N$733: IC39.5 SV77.7 SV77.8
N$734: IC39.4 SV77.9 SV77.10
N$735: IC39.3 SV77.11 SV77.12
N$736: IC39.2 SV77.13 SV77.14
N$737: IC39.1 SV77.15 SV77.16
N$738: IC40.9 SV80.1 SV80.2
N$739: IC40.10 SV80.3 SV80.4
N$740: IC40.11 SV80.5 SV80.6
N$741: IC40.12 SV80.7 SV80.8
N$742: IC40.13 SV80.9 SV80.10
N$743: IC40.14 SV80.11 SV80.12
N$744: IC40.15 SV80.13 SV80.14
N$745: IC40.16 SV80.15 SV80.16
N$746: IC40.8 SV79.1 SV79.2
N$747: IC40.7 SV79.3 SV79.4
N$748: IC40.6 SV79.5 SV79.6
N$749: IC40.5 SV79.7 SV79.8
N$750: IC40.4 SV79.9 SV79.10
N$751: IC40.3 SV79.11 SV79.12
N$752: IC40.2 SV79.13 SV79.14
N$753: IC40.1 SV79.15 SV79.16
N$754: IC41.9 SV82.1 SV82.2
N$755: IC41.10 SV82.3 SV82.4
N$756: IC41.11 SV82.5 SV82.6
N$757: IC41.12 SV82.7 SV82.8
N$758: IC41.13 SV82.9 SV82.10
N$759: IC41.14 SV82.11 SV82.12
N$760: IC41.15 SV82.13 SV82.14
N$761: IC41.16 SV82.15 SV82.16
N$762: IC41.8 SV81.1 SV81.2
N$763: IC41.7 SV81.3 SV81.4
N$764: IC41.6 SV81.5 SV81.6
N$765: IC41.5 SV81.7 SV81.8
N$766: IC41.4 SV81.9 SV81.10
N$767: IC41.3 SV81.11 SV81.12
N$768: IC41.2 SV81.13 SV81.14
N$769: IC41.1 SV81.15 SV81.16
N$770: IC42.9 SV84.1 SV84.2
N$771: IC42.10 SV84.3 SV84.4
N$772: IC42.11 SV84.5 SV84.6
N$773: IC42.12 SV84.7 SV84.8
N$774: IC42.13 SV84.9 SV84.10
N$775: IC42.14 SV84.11 SV84.12
N$776: IC42.15 SV84.13 SV84.14
N$777: IC42.16 SV84.15 SV84.16
N$778: IC42.8 SV83.1 SV83.2
N$779: IC42.7 SV83.3 SV83.4
N$780: IC42.6 SV83.5 SV83.6
N$781: IC42.5 SV83.7 SV83.8
N$782: IC42.4 SV83.9 SV83.10
N$783: IC42.3 SV83.11 SV83.12
N$784: IC42.2 SV83.13 SV83.14
N$785: IC42.1 SV83.15 SV83.16
N$786: IC43.9 SV86.1 SV86.2
N$787: IC43.10 SV86.3 SV86.4
N$788: IC43.11 SV86.5 SV86.6
N$789: IC43.12 SV86.7 SV86.8
N$790: IC43.13 SV86.9 SV86.10
N$791: IC43.14 SV86.11 SV86.12
N$792: IC43.15 SV86.13 SV86.14
N$793: IC43.16 SV86.15 SV86.16
N$794: IC43.8 SV85.1 SV85.2
N$795: IC43.7 SV85.3 SV85.4
N$796: IC43.6 SV85.5 SV85.6
N$797: IC43.5 SV85.7 SV85.8
N$798: IC43.4 SV85.9 SV85.10
N$799: IC43.3 SV85.11 SV85.12
N$800: IC43.2 SV85.13 SV85.14
N$801: IC43.1 SV85.15 SV85.16
N$802: IC44.9 SV88.1 SV88.2
N$803: IC44.10 SV88.3 SV88.4
N$804: IC44.11 SV88.5 SV88.6
N$805: IC44.12 SV88.7 SV88.8
N$806: IC44.13 SV88.9 SV88.10
N$807: IC44.14 SV88.11 SV88.12
N$808: IC44.15 SV88.13 SV88.14
N$809: IC44.16 SV88.15 SV88.16
N$810: IC44.8 SV87.1 SV87.2
N$811: IC44.7 SV87.3 SV87.4
N$812: IC44.6 SV87.5 SV87.6
N$813: IC44.5 SV87.7 SV87.8
N$814: IC44.4 SV87.9 SV87.10
N$815: IC44.3 SV87.11 SV87.12
N$816: IC44.2 SV87.13 SV87.14
N$817: IC44.1 SV87.15 SV87.16
N$818: IC45.9 SV90.1 SV90.2
N$819: IC45.10 SV90.3 SV90.4
N$820: IC45.11 SV90.5 SV90.6
N$821: IC45.12 SV90.7 SV90.8
N$822: IC45.13 SV90.9 SV90.10
N$823: IC45.14 SV90.11 SV90.12
N$824: IC45.15 SV90.13 SV90.14
N$825: IC45.16 SV90.15 SV90.16
N$826: IC45.8 SV89.1 SV89.2
N$827: IC45.7 SV89.3 SV89.4
N$828: IC45.6 SV89.5 SV89.6
N$829: IC45.5 SV89.7 SV89.8
N$830: IC45.4 SV89.9 SV89.10
N$831: IC45.3 SV89.11 SV89.12
N$832: IC45.2 SV89.13 SV89.14
N$833: IC45.1 SV89.15 SV89.16
N$834: IC46.9 SV92.1 SV92.2
N$835: IC46.10 SV92.3 SV92.4
N$836: IC46.11 SV92.5 SV92.6
N$837: IC46.12 SV92.7 SV92.8
N$838: IC46.13 SV92.9 SV92.10
N$839: IC46.14 SV92.11 SV92.12
N$840: IC46.15 SV92.13 SV92.14
N$841: IC46.16 SV92.15 SV92.16
N$842: IC46.8 SV91.1 SV91.2
N$843: IC46.7 SV91.3 SV91.4
N$844: IC46.6 SV91.5 SV91.6
N$845: IC46.5 SV91.7 SV91.8
N$846: IC46.4 SV91.9 SV91.10
N$847: IC46.3 SV91.11 SV91.12
N$848: IC46.2 SV91.13 SV91.14
N$849: IC46.1 SV91.15 SV91.16
N$850: IC47.9 SV94.1 SV94.2
N$851: IC47.10 SV94.3 SV94.4
N$852: IC47.11 SV94.5 SV94.6
N$853: IC47.12 SV94.7 SV94.8
N$854: IC47.13 SV94.9 SV94.10
N$855: IC47.14 SV94.11 SV94.12
N$856: IC47.15 SV94.13 SV94.14
N$857: IC47.16 SV94.15 SV94.16
N$858: IC47.8 SV93.1 SV93.2
N$859: IC47.7 SV93.3 SV93.4
N$860: IC47.6 SV93.5 SV93.6
N$861: IC47.5 SV93.7 SV93.8
N$862: IC47.4 SV93.9 SV93.10
N$863: IC47.3 SV93.11 SV93.12
N$864: IC47.2 SV93.13 SV93.14
N$865: IC47.1 SV93.15 SV93.16
N$866: IC48.9 SV96.1 SV96.2
N$867: IC48.10 SV96.3 SV96.4
N$868: IC48.11 SV96.5 SV96.6
N$869: IC48.12 SV96.7 SV96.8
N$870: IC48.13 SV96.9 SV96.10
N$871: IC48.14 SV96.11 SV96.12
N$872: IC48.15 SV96.13 SV96.14
N$873: IC48.16 SV96.15 SV96.16
N$874: IC48.8 SV95.1 SV95.2
N$875: IC48.7 SV95.3 SV95.4
N$876: IC48.6 SV95.5 SV95.6
N$877: IC48.5 SV95.7 SV95.8
N$878: IC48.4 SV95.9 SV95.10
N$879: IC48.3 SV95.11 SV95.12
N$880: IC48.2 SV95.13 SV95.14
N$881: IC48.1 SV95.15 SV95.16
N$882: IC49.9 SV98.1 SV98.2
N$883: IC49.10 SV98.3 SV98.4
N$884: IC49.11 SV98.5 SV98.6
N$885: IC49.12 SV98.7 SV98.8
N$886: IC49.13 SV98.9 SV98.10
N$887: IC49.14 SV98.11 SV98.12
N$888: IC49.15 SV98.13 SV98.14
N$889: IC49.16 SV98.15 SV98.16
N$890: IC49.8 SV97.1 SV97.2
N$891: IC49.7 SV97.3 SV97.4
N$892: IC49.6 SV97.5 SV97.6
N$893: IC49.5 SV97.7 SV97.8
N$894: IC49.4 SV97.9 SV97.10
N$895: IC49.3 SV97.11 SV97.12
N$896: IC49.2 SV97.13 SV97.14
N$897: IC49.1 SV97.15 SV97.16
N$898: IC50.9 SV100.1 SV100.2
N$899: IC50.10 SV100.3 SV100.4
N$900: IC50.11 SV100.5 SV100.6
N$901: IC50.12 SV100.7 SV100.8
N$902: IC50.13 SV100.9 SV100.10
N$903: IC50.14 SV100.11 SV100.12
N$904: IC50.15 SV100.13 SV100.14
N$905: IC50.16 SV100.15 SV100.16
N$906: IC50.8 SV99.1 SV99.2
N$907: IC50.7 SV99.3 SV99.4
N$908: IC50.6 SV99.5 SV99.6
N$909: IC50.5 SV99.7 SV99.8
N$910: IC50.4 SV99.9 SV99.10
N$911: IC50.3 SV99.11 SV99.12
N$912: IC50.2 SV99.13 SV99.14
N$913: IC50.1 SV99.15 SV99.16
N$914: IC51.9 SV102.1 SV102.2
N$915: IC51.10 SV102.3 SV102.4
N$916: IC51.11 SV102.5 SV102.6
N$917: IC51.12 SV102.7 SV102.8
N$918: IC51.13 SV102.9 SV102.10
N$919: IC51.14 SV102.11 SV102.12
N$920: IC51.15 SV102.13 SV102.14
N$921: IC51.16 SV102.15 SV102.16
N$922: IC51.8 SV101.1 SV101.2
N$923: IC51.7 SV101.3 SV101.4
N$924: IC51.6 SV101.5 SV101.6
N$925: IC51.5 SV101.7 SV101.8
N$926: IC51.4 SV101.9 SV101.10
N$927: IC51.3 SV101.11 SV101.12
N$928: IC51.2 SV101.13 SV101.14
N$929: IC51.1 SV101.15 SV101.16
N$930: IC52.9 SV104.1 SV104.2
N$931: IC52.10 SV104.3 SV104.4
N$932: IC52.11 SV104.5 SV104.6
N$933: IC52.12 SV104.7 SV104.8
N$934: IC52.13 SV104.9 SV104.10
N$935: IC52.14 SV104.11 SV104.12
N$936: IC52.15 SV104.13 SV104.14
N$937: IC52.16 SV104.15 SV104.16
N$938: IC52.8 SV103.1 SV103.2
N$939: IC52.7 SV103.3 SV103.4
N$940: IC52.6 SV103.5 SV103.6
N$941: IC52.5 SV103.7 SV103.8
N$942: IC52.4 SV103.9 SV103.10
N$943: IC52.3 SV103.11 SV103.12
N$944: IC52.2 SV103.13 SV103.14
N$945: IC52.1 SV103.15 SV103.16
N$946: IC53.9 SV106.1 SV106.2
N$947: IC53.10 SV106.3 SV106.4
N$948: IC53.11 SV106.5 SV106.6
N$949: IC53.12 SV106.7 SV106.8
N$950: IC53.13 SV106.9 SV106.10
N$951: IC53.14 SV106.11 SV106.12
N$952: IC53.15 SV106.13 SV106.14
N$953: IC53.16 SV106.15 SV106.16
N$954: IC53.8 SV105.1 SV105.2
N$955: IC53.7 SV105.3 SV105.4
N$956: IC53.6 SV105.5 SV105.6
N$957: IC53.5 SV105.7 SV105.8
N$958: IC53.4 SV105.9 SV105.10
N$959: IC53.3 SV105.11 SV105.12
N$960: IC53.2 SV105.13 SV105.14
N$961: IC53.1 SV105.15 SV105.16
N$962: IC54.9 SV108.1 SV108.2
N$963: IC54.10 SV108.3 SV108.4
N$964: IC54.11 SV108.5 SV108.6
N$965: IC54.12 SV108.7 SV108.8
N$966: IC54.13 SV108.9 SV108.10
N$967: IC54.14 SV108.11 SV108.12
N$968: IC54.15 SV108.13 SV108.14
N$969: IC54.16 SV108.15 SV108.16
N$970: IC54.8 SV107.1 SV107.2
N$971: IC54.7 SV107.3 SV107.4
N$972: IC54.6 SV107.5 SV107.6
N$973: IC54.5 SV107.7 SV107.8
N$974: IC54.4 SV107.9 SV107.10
N$975: IC54.3 SV107.11 SV107.12
N$976: IC54.2 SV107.13 SV107.14
N$977: IC54.1 SV107.15 SV107.16
N$978: IC55.9 SV110.1 SV110.2
N$979: IC55.10 SV110.3 SV110.4
N$980: IC55.11 SV110.5 SV110.6
N$981: IC55.12 SV110.7 SV110.8
N$982: IC55.13 SV110.9 SV110.10
N$983: IC55.14 SV110.11 SV110.12
N$984: IC55.15 SV110.13 SV110.14
N$985: IC55.16 SV110.15 SV110.16
N$986: IC55.8 SV109.1 SV109.2
N$987: IC55.7 SV109.3 SV109.4
N$988: IC55.6 SV109.5 SV109.6
N$989: IC55.5 SV109.7 SV109.8
N$990: IC55.4 SV109.9 SV109.10
N$991: IC55.3 SV109.11 SV109.12
N$992: IC55.2 SV109.13 SV109.14
N$993: IC55.1 SV109.15 SV109.16
N$994: IC56.9 SV112.1 SV112.2
N$995: IC56.10 SV112.3 SV112.4
N$996: IC56.11 SV112.5 SV112.6
N$997: IC56.12 SV112.7 SV112.8
N$998: IC56.13 SV112.9 SV112.10
N$999: IC56.14 SV112.11 SV112.12
N$1000: IC56.15 SV112.13 SV112.14
N$1001: IC56.16 SV112.15 SV112.16
N$1002: IC56.8 SV111.1 SV111.2
N$1003: IC56.7 SV111.3 SV111.4
N$1004: IC56.6 SV111.5 SV111.6
N$1005: IC56.5 SV111.7 SV111.8
N$1006: IC56.4 SV111.9 SV111.10
N$1007: IC56.3 SV111.11 SV111.12
N$1008: IC56.2 SV111.13 SV111.14
N$1009: IC56.1 SV111.15 SV111.16
N$1010: IC57.9 SV114.1 SV114.2
N$1011: IC57.10 SV114.3 SV114.4
N$1012: IC57.11 SV114.5 SV114.6
N$1013: IC57.12 SV114.7 SV114.8
N$1014: IC57.13 SV114.9 SV114.10
N$1015: IC57.14 SV114.11 SV114.12
N$1016: IC57.15 SV114.13 SV114.14
N$1017: IC57.16 SV114.15 SV114.16
N$1018: IC57.8 SV113.1 SV113.2
N$1019: IC57.7 SV113.3 SV113.4
N$1020: IC57.6 SV113.5 SV113.6
N$1021: IC57.5 SV113.7 SV113.8
N$1022: IC57.4 SV113.9 SV113.10
N$1023: IC57.3 SV113.11 SV113.12
N$1024: IC57.2 SV113.13 SV113.14
N$1025: IC57.1 SV113.15 SV113.16
N$1026: IC58.9 SV116.1 SV116.2
N$1027: IC58.10 SV116.3 SV116.4
N$1028: IC58.11 SV116.5 SV116.6
N$1029: IC58.12 SV116.7 SV116.8
N$1030: IC58.13 SV116.9 SV116.10
N$1031: IC58.14 SV116.11 SV116.12
N$1032: IC58.15 SV116.13 SV116.14
N$1033: IC58.16 SV116.15 SV116.16
N$1034: IC58.8 SV115.1 SV115.2
N$1035: IC58.7 SV115.3 SV115.4
N$1036: IC58.6 SV115.5 SV115.6
N$1037: IC58.5 SV115.7 SV115.8
N$1038: IC58.4 SV115.9 SV115.10
N$1039: IC58.3 SV115.11 SV115.12
N$1040: IC58.2 SV115.13 SV115.14
N$1041: IC58.1 SV115.15 SV115.16
N$1042: IC59.9 SV118.1 SV118.2
N$1043: IC59.10 SV118.3 SV118.4
N$1044: IC59.11 SV118.5 SV118.6
N$1045: IC59.12 SV118.7 SV118.8
N$1046: IC59.13 SV118.9 SV118.10
N$1047: IC59.14 SV118.11 SV118.12
N$1048: IC59.15 SV118.13 SV118.14
N$1049: IC59.16 SV118.15 SV118.16
N$1050: IC59.8 SV117.1 SV117.2
N$1051: IC59.7 SV117.3 SV117.4
N$1052: IC59.6 SV117.5 SV117.6
N$1053: IC59.5 SV117.7 SV117.8
N$1054: IC59.4 SV117.9 SV117.10
N$1055: IC59.3 SV117.11 SV117.12
N$1056: IC59.2 SV117.13 SV117.14
N$1057: IC59.1 SV117.15 SV117.16
N$1058: IC60.9 SV120.1 SV120.2
N$1059: IC60.10 SV120.3 SV120.4
N$1060: IC60.11 SV120.5 SV120.6
N$1061: IC60.12 SV120.7 SV120.8
N$1062: IC60.13 SV120.9 SV120.10
N$1063: IC60.14 SV120.11 SV120.12
N$1064: IC60.15 SV120.13 SV120.14
N$1065: IC60.16 SV120.15 SV120.16
N$1066: IC60.8 SV119.1 SV119.2
N$1067: IC60.7 SV119.3 SV119.4
N$1068: IC60.6 SV119.5 SV119.6
N$1069: IC60.5 SV119.7 SV119.8
N$1070: IC60.4 SV119.9 SV119.10
N$1071: IC60.3 SV119.11 SV119.12
N$1072: IC60.2 SV119.13 SV119.14
N$1073: IC60.1 SV119.15 SV119.16

### Notes on the sheet
- PDP-8/E Compatible I/O Breadboard
- Douglas Electronics